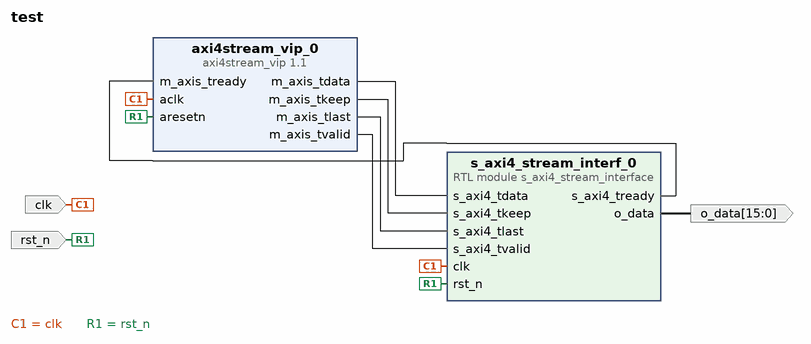
[diagram p0: block diagram of the top level]
# Vivado block design test, xc7z020clg400-2, Vivado 2018.3
create_bd_design test

create_bd_port -dir I -type clk clk
set_property -dict {CONFIG.FREQ_HZ 100000000} [get_bd_ports clk]
create_bd_port -dir I -type rst rst_n
create_bd_port -dir O -from 15 -to 0 o_data

create_bd_cell -type ip -vlnv xilinx.com:ip:axi4stream_vip:1.1 axi4stream_vip_0
set_property -dict [list \
  CONFIG.HAS_TKEEP 1 \
  CONFIG.HAS_TLAST 1 \
  CONFIG.HAS_TREADY 1 \
  CONFIG.HAS_TSTRB 0 \
  CONFIG.INTERFACE_MODE MASTER \
  CONFIG.TDATA_NUM_BYTES 2 \
  CONFIG.TDEST_WIDTH 0 \
  CONFIG.TID_WIDTH 0 \
  CONFIG.TUSER_WIDTH 0 \
] [get_bd_cells axi4stream_vip_0]
create_bd_cell -type module -reference s_axi4_stream_interface s_axi4_stream_interf_0

# ---- connections ----

connect_bd_net [get_bd_pins axi4stream_vip_0/m_axis_tdata] [get_bd_pins s_axi4_stream_interf_0/s_axi4_tdata]
connect_bd_net [get_bd_pins axi4stream_vip_0/m_axis_tkeep] [get_bd_pins s_axi4_stream_interf_0/s_axi4_tkeep]
connect_bd_net [get_bd_pins axi4stream_vip_0/m_axis_tlast] [get_bd_pins s_axi4_stream_interf_0/s_axi4_tlast]
connect_bd_net [get_bd_pins s_axi4_stream_interf_0/s_axi4_tready] [get_bd_pins axi4stream_vip_0/m_axis_tready]
connect_bd_net [get_bd_pins axi4stream_vip_0/m_axis_tvalid] [get_bd_pins s_axi4_stream_interf_0/s_axi4_tvalid]
connect_bd_net [get_bd_ports clk] [get_bd_pins axi4stream_vip_0/aclk] [get_bd_pins s_axi4_stream_interf_0/clk]
connect_bd_net [get_bd_ports rst_n] [get_bd_pins axi4stream_vip_0/aresetn] [get_bd_pins s_axi4_stream_interf_0/rst_n]
connect_bd_net [get_bd_pins s_axi4_stream_interf_0/o_data] [get_bd_ports o_data]

validate_bd_design
save_bd_design
